# Altium schematic sheet PAGE1-Power.SchDoc
size 513 x 386 mm
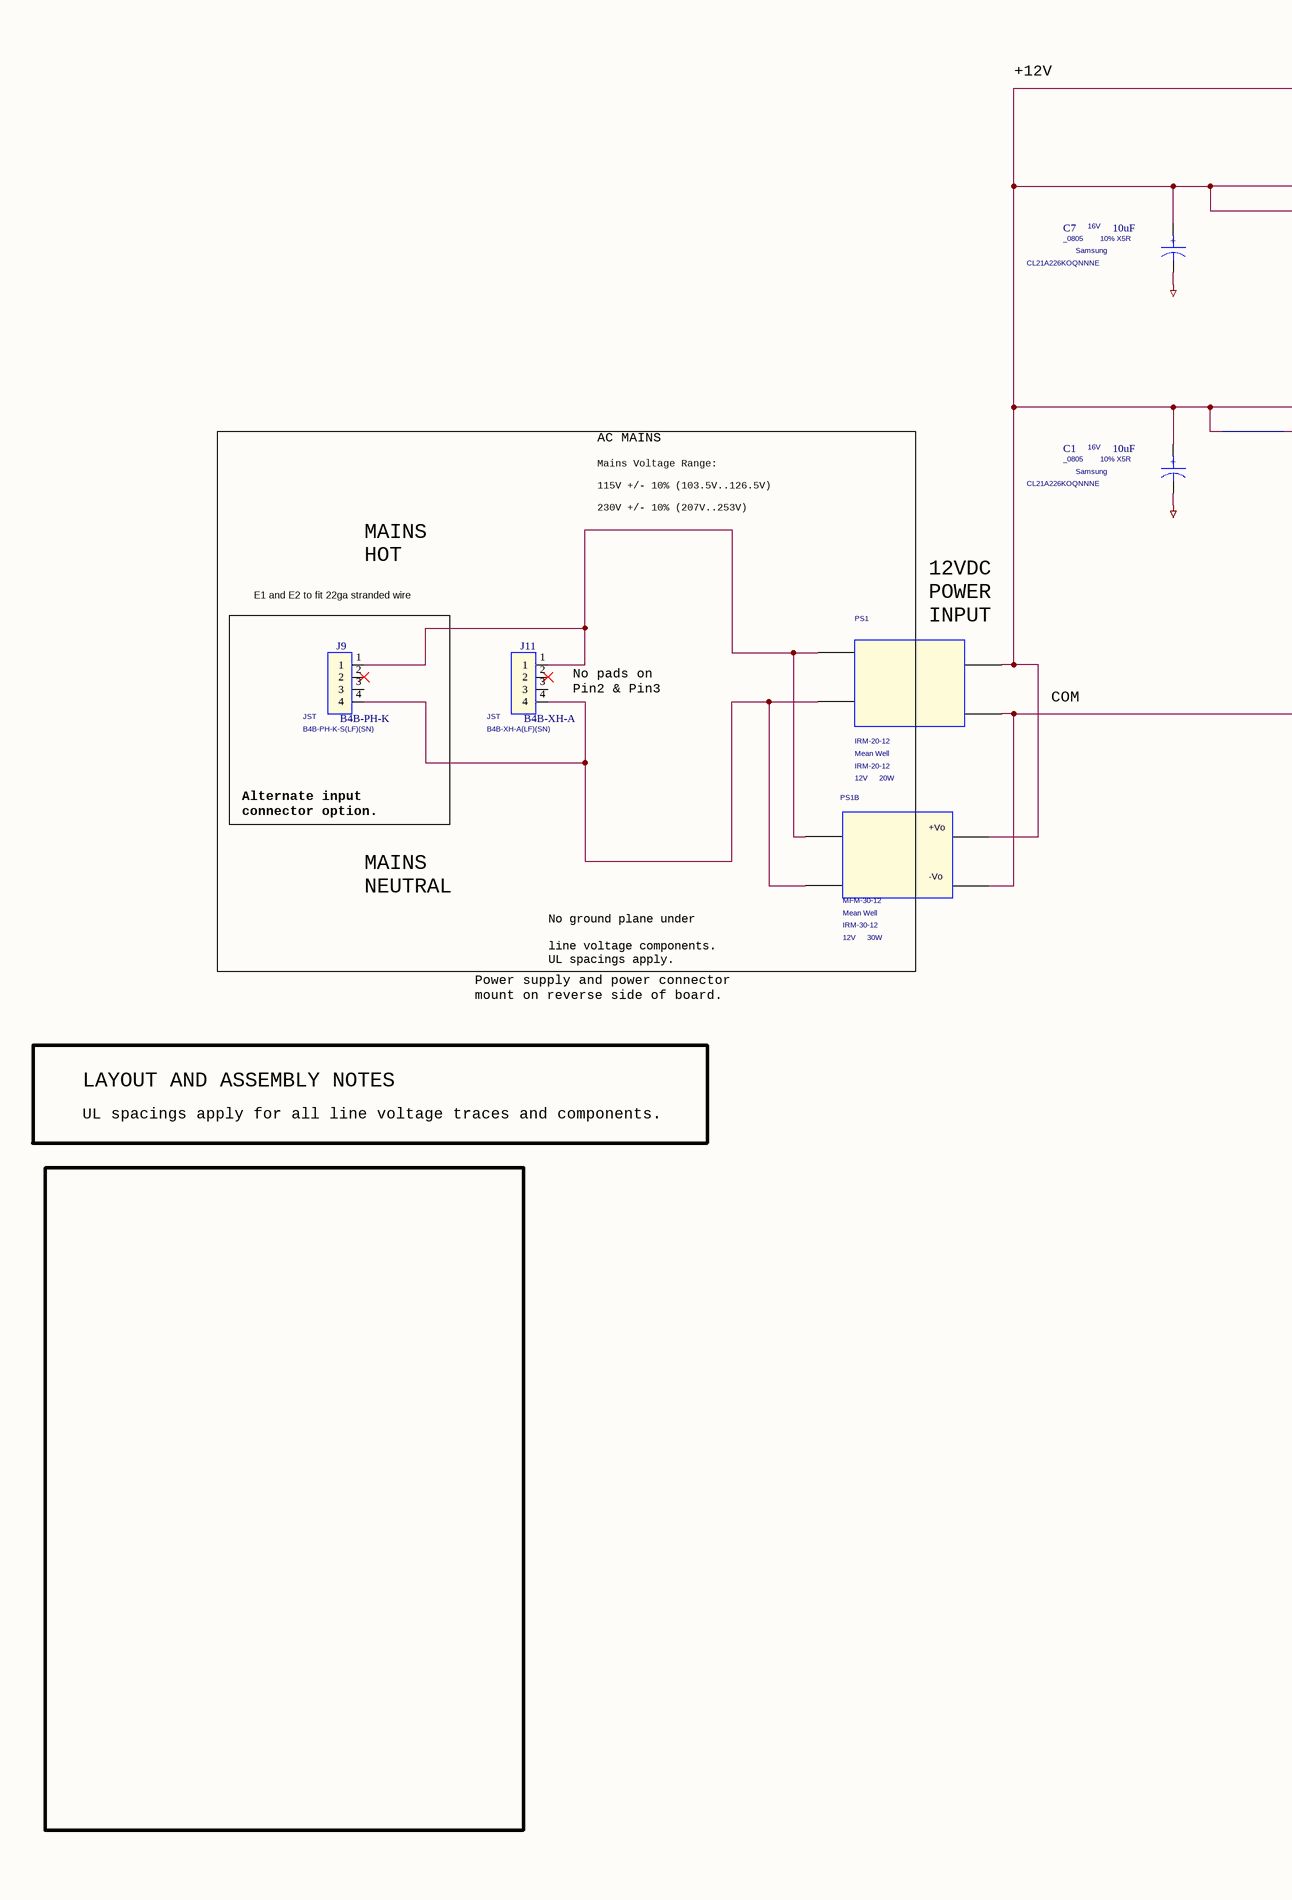
[diagram p0: PAGE1-Power.SchDoc, left]
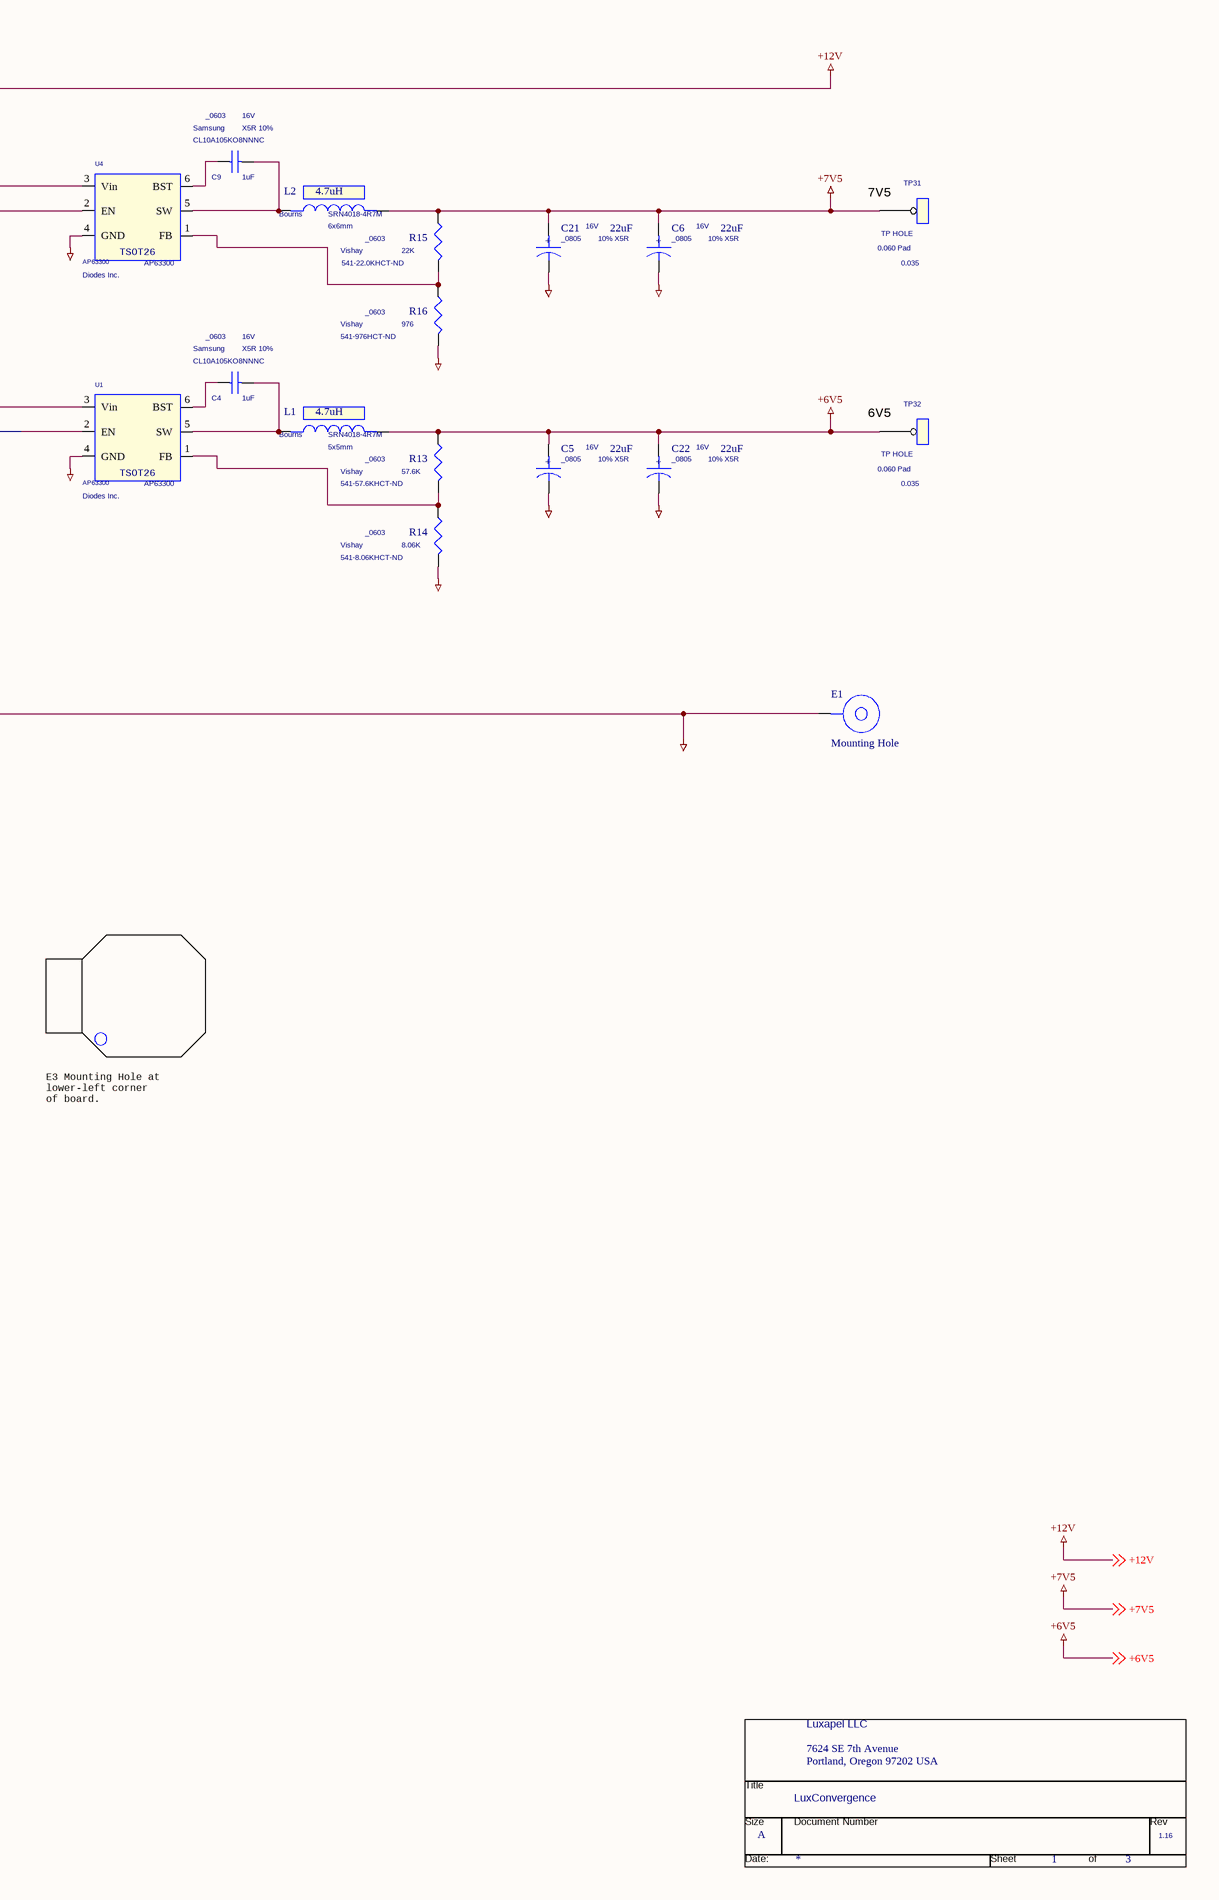
[diagram p1: PAGE1-Power.SchDoc, right]

## Parts
*  RevCode: 1.16  Title: LuxConvergence  OrgName: Luxapel LLC  OrgAddr1: 7624 SE 7th Avenue  OrgAddr2: Portland, Oregon 97202 USA  Page Size: A  Page Number: 1  Page Count: 3  (hidden comment: TitleBlock3)  (graphical)
C1  10uF  Precision: 10% X5R  Voltage: 16V  Mfg: Samsung  P/N: CL21A226KOQNNNE  [_0805]
C4  1uF  Precision: X5R 10%  Voltage: 16V  Mfg: Samsung  P/N: CL10A105KO8NNNC  [_0603]
C5  22uF  Precision: 10% X5R  Voltage: 16V  [_0805]
C6  22uF  Precision: 10% X5R  Voltage: 16V  [_0805]
C7  10uF  Precision: 10% X5R  Voltage: 16V  Mfg: Samsung  P/N: CL21A226KOQNNNE  [_0805]
C9  1uF  Precision: X5R 10%  Voltage: 16V  Mfg: Samsung  P/N: CL10A105KO8NNNC  [_0603]
C21  22uF  Voltage: 16V  Precision: 10% X5R  [_0805]
C22  22uF  Voltage: 16V  Precision: 10% X5R  [_0805]
E1  Mounting Hole  [MountingHole]
J9  B4B-PH-K  P/N: B4B-PH-K-S(LF)(SN)  Mfg: JST  [SIP-4]
J11  B4B-XH-A  P/N: B4B-XH-A(LF)(SN)  Mfg: JST  [SIP-4]
L1  4.7uH  P/N: SRN4018-4R7M  Mfg: Bourns  [5x5mm]
L2  4.7uH  Mfg: Bourns  P/N: SRN4018-4R7M  [6x6mm]
PS1  IRM-20-12  Mfg: Mean Well  Voltage: 12V  Power: 20W  [ThruHolePS]
PS1B  MFM-30-12  Mfg: Mean Well  P/N: IRM-30-12  Voltage: 12V  Power: 30W  [THRUHOLEPS - duplicate]
R13  57.6K  P/N: 541-57.6KHCT-ND  Mfg: Vishay  [_0603]
R14  8.06K  P/N: 541-8.06KHCT-ND  Mfg: Vishay  [_0603]
R15  22K  P/N: 541-22.0KHCT-ND  Mfg: Vishay  [_0603]
R16  976  P/N: 541-976HCT-ND  Mfg: Vishay  [_0603]
TP31  TP HOLE  Notes: 0.060 Pad  [0.035]
TP32  TP HOLE  Notes: 0.060 Pad  [0.035]
U1  AP63300  Mfg: Diodes Inc.  [SOIC-8]
U4  AP63300  Mfg: Diodes Inc.  [SOIC-8]

## Blocks framed on the sheet
AC MAINS: J11 PS1 PS1B
E1 and E2 to fit 22ga stranded wire: J9

## Nets
+6V5: C5.1 C22.1 L1.1 R13.1 TP32.1 ; off-sheet +6V5
+7V5: C6.1 C21.1 L2.1 R15.1 TP31.1 ; off-sheet +7V5
+12V: C1.1 C7.1 PS1.+Vo PS1B.+Vo U1.2(EN) U1.3(Vin) U4.2(EN) U4.3(Vin) ; off-sheet +12V
GND_POWER.global: C1.2 C5.2 C6.2 C7.2 C21.2 C22.2 E1.1 PS1.-Vo PS1B.-Vo R14.2 R16.2 U1.4(GND) U4.4(GND)
NetC4_1: C4.1 U1.6(BST)
NetC4_2: C4.2 L1.2 U1.5(SW)
NetC9_1: C9.1 U4.6(BST)
NetC9_2: C9.2 L2.2 U4.5(SW)
NetJ9_1: J9.1 J11.1 PS1.ACL PS1B.ACN
NetJ9_4: J9.4 J11.4 PS1.ACN PS1B.ACL
NetR13_2: R13.2 R14.1 U1.1(FB)
NetR15_2: R15.2 R16.1 U4.1(FB)

Not connected (* = marked no-connect by the designer): J9 2* 3; J11 2* 3

## Notes on the sheet
- +12V
- (near TP31) 7V5
- (near TP32) 6V5
- Mains Voltage Range:
  115V +/- 10% (103.5V..126.5V)
  230V +/- 10% (207V..253V)
- MAINS
  HOT
- (near PS1) 12VDC
  POWER
  INPUT
- (near J11) No pads on
  Pin2 & Pin3
- COM
- Alternate input
  connector option.
- (near PS1B) +Vo
- MAINS
  NEUTRAL
- (near PS1B) -Vo
- No ground plane under
  line voltage components.
  UL spacings apply.
- Power supply and power connector
  mount on reverse side of board.
- LAYOUT AND ASSEMBLY NOTES
- E3 Mounting Hole at
  lower-left corner
  of board.
- UL spacings apply for all line voltage traces and components.
- (in symbol CAPACITOR POL/SM) +
- (in symbol NCP3170_0_2) TSOT26
- (in symbol TitleBlock3) Title; Size; Document Number; Rev; Date:; Sheet; of

## Library data of the parts
* = TitleBlock3: Doc: LuxConvergence_1_0; Page Create Date: March  8, 1995; Page Modify Date: *
C1 C7 = CAPACITOR POL/SM: PCB Footprint: _0805
C4 C9 = CAPACITOR NON-POL: Name: I16777427; Pin Numbers Visible: False; EDIForiginalOrigin: (pt 0 0); EDIFviewName: NORMAL; Implementation Type: <none>; Color: Default; Pin Names Visible: False; Graphic: CAPACITOR NON-POL; DataSheet: Yes; PCB Footprint: _0603
C5 C6 = CAPACITOR POL/SM: Mfg: Samsung; P/N: CL21A226KOQNNNE; PCB Footprint: _0805
C21 C22 = CAPACITOR POL/SM: P/N: CL21A226KOQNNNE; Mfg: Samsung; PCB Footprint: _0805
E1 = hole_0: OrCADviewType: LIBRARY_PART; Name: hole.Normal; Pin Numbers Visible: False; EDIForiginalOrigin: (pt 0 10); EDIFviewName: NORMAL; Pin Names Visible: False; PCB Footprint: MountingHole
J9 J11 = CON4_8: DataSheet: Yes; PCB Footprint: SIP-4
L1 L2 = INDUCTOR FERRITE/SM: Power: 1A
  L1: PCB Footprint: 5x5mm
  L2: PCB Footprint: 6x6mm
PS1 = VOFM-5-5: Pin Numbers Visible: True; EDIForiginalOrigin: (pt 0 0); EDIFviewName: NORMAL; Implementation Type: <none>; Graphic: VOFM-5-5.Normal; Pin Names Visible: True; PCB Footprint: ThruHolePS; Color: Default; P/N: IRM-20-12; DataSheet: Yes
PS1B = VOFM-5-5_5: EDIFviewName: NORMAL; EDIForiginalOrigin: (pt 0 0); Pin Names Visible: True; Implementation Type: <none>; Graphic: VOFM-5-5.Normal; PCB Footprint: ThruHolePS; Pin Numbers Visible: True; Color: Default; DataSheet: Yes
R13-R16 = RESISTOR: Voltage: 75V; Precision: 5%; Power: 0.10W; PCB Footprint: _0603
TP31 TP32 = TEST POINT_1: OrCADviewType: LIBRARY_PART; Name: I16753259; Pin Numbers Visible: False; Pin Names Visible: True; EDIForiginalOrigin: (pt 0 0); EDIFviewName: NORMAL; Implementation Type: <none>; PCB Footprint: 0.035; Color: Default; Graphic: TEST POINT; DataSheet: Yes
U1 U4 = NCP3170_0_2: PCB Footprint: SOIC-8; P/N: AP63300